# EAGLE design tqfp-sandwich-ui (EAGLE 9.6.2)
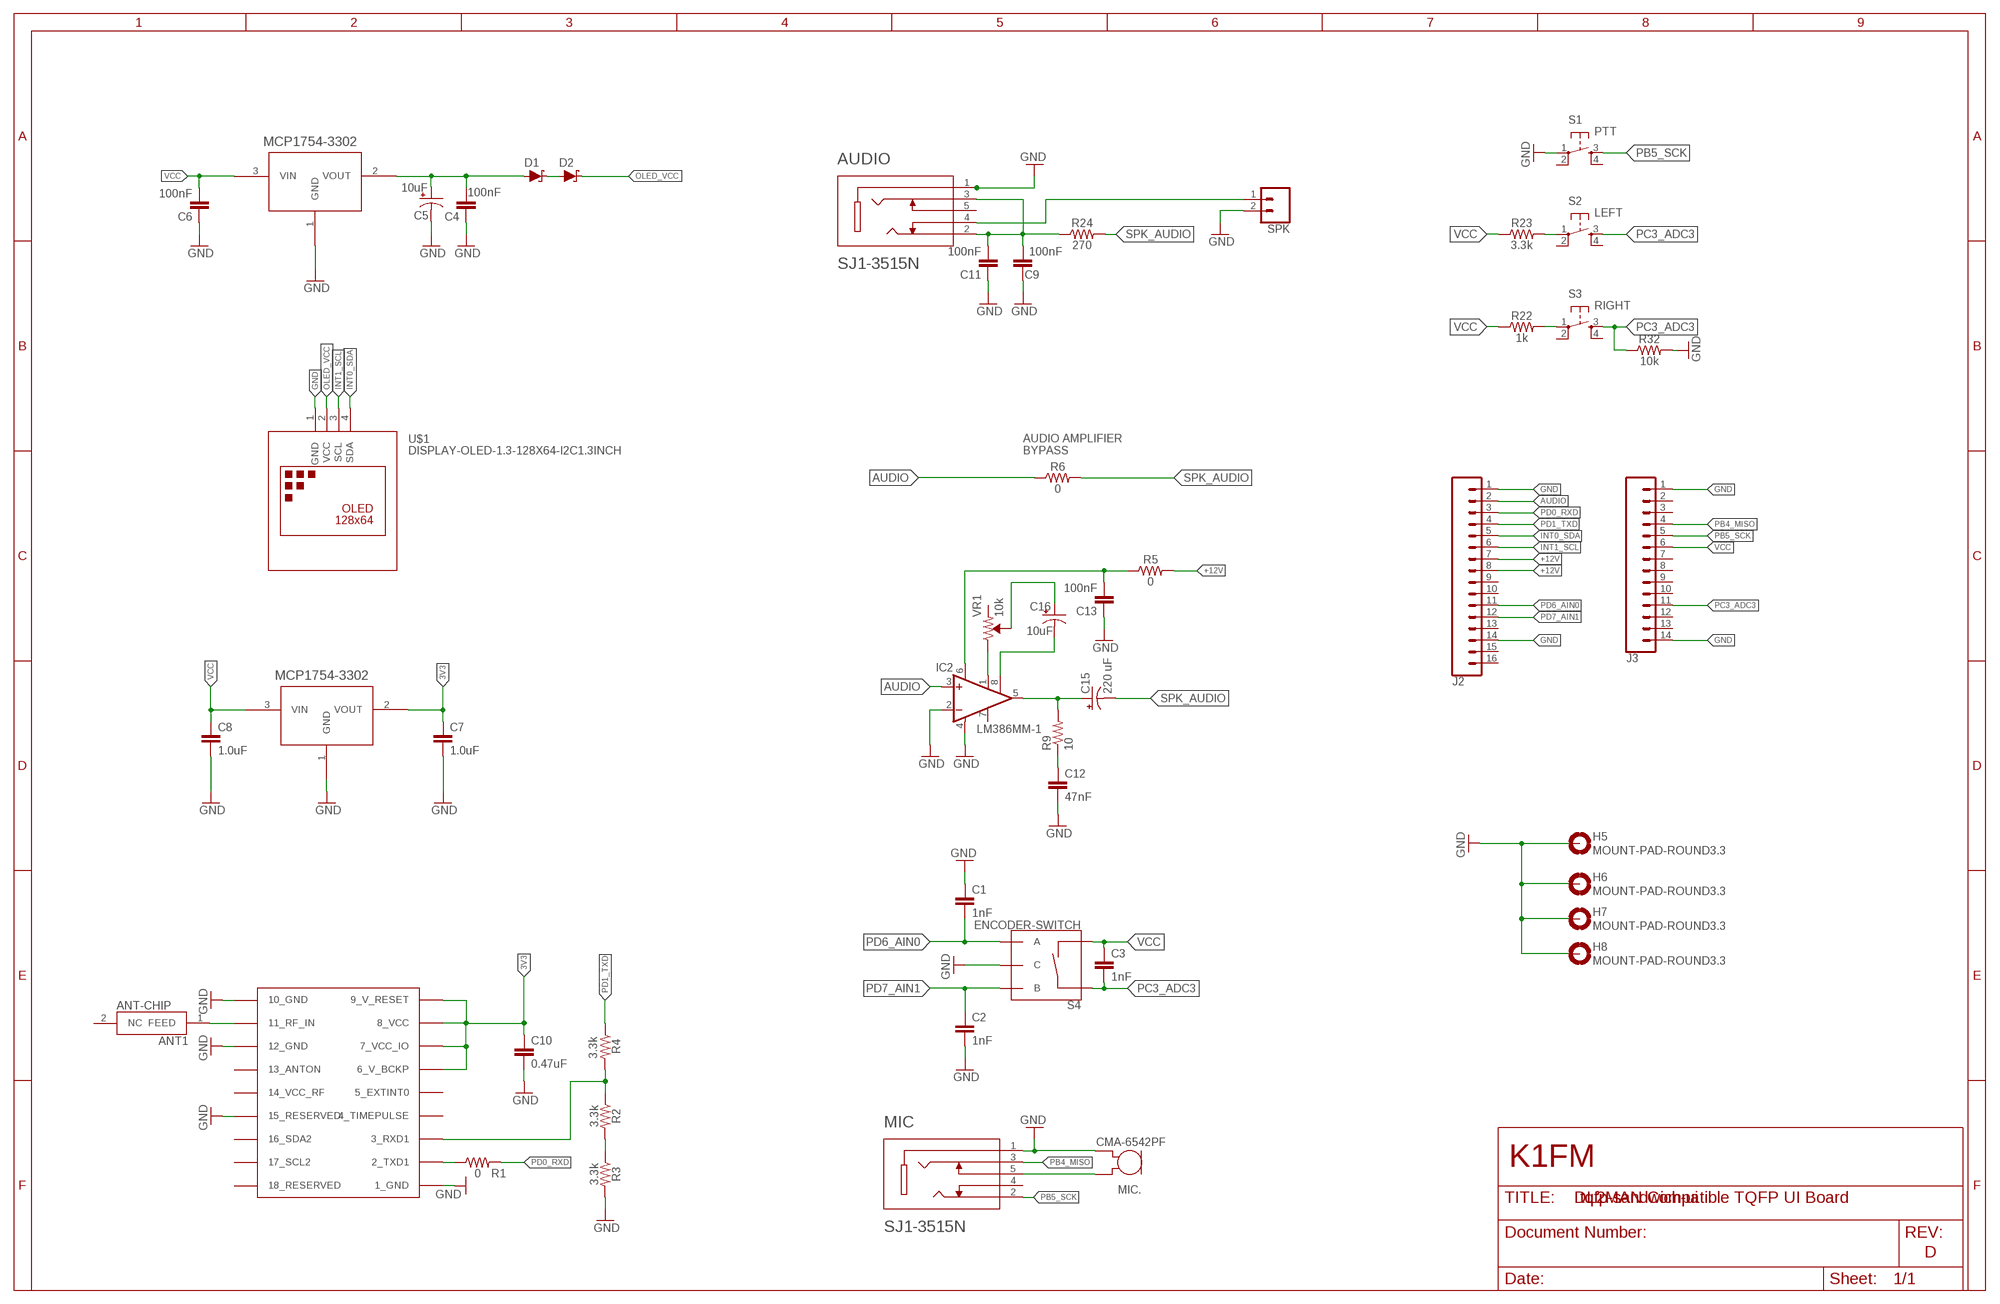
[diagram p0: schematic, sheet 1]

## Parts
ANT-CHIP  ANT1  1575AT43A0040E  [1575AT43A0040E]
AUDIO  SJ1-3515N  [CUI_SJ1-3515N]
C1  1nF  1.0NF/1000PF-0603-50V-10%  [0603]
C2  1nF  1.0NF/1000PF-0603-50V-10%  [0603]
C3  1nF  1.0NF/1000PF-0603-50V-10%  [0603]
C4  100nF  1.0NF/1000PF-0603-50V-10%  [0603]
C5  10uF  10UF-POLAR-EIA3216-16V-10%(TANT)  [EIA3216]
C6  100nF  1.0NF/1000PF-0603-50V-10%  [0603]
C7  1.0uF  1.0UF-0603-16V-10%  [0603]
C8  1.0uF  1.0UF-0603-16V-10%  [0603]
C9  100nF  1.0NF/1000PF-0603-50V-10%  [0603]
C10  0.47uF  0.1UF-0603-25V-5%  [0603]
C11  100nF  1.0NF/1000PF-0603-50V-10%  [0603]
C12  47nF  47NF-0603-25V-5%  [0603]
C13  100nF  1.0NF/1000PF-0603-50V-10%  [0603]
C15  220 uF  CPOL-USC  [PANASONIC_C]
C16  10uF  10UF-POLAR-EIA3216-16V-10%(TANT)  [EIA3216]
D1  1A/23V/620mV  DIODE-SCHOTTKY-BAT20J  [SOD-323]
D2  1A/23V/620mV  DIODE-SCHOTTKY-BAT20J  [SOD-323]
GPS1  UBLOX_MAX  [UBLOX_MAX]
H5  MOUNT-PAD-ROUND3.3  [3,3-PAD]
H6  MOUNT-PAD-ROUND3.3  [3,3-PAD]
H7  MOUNT-PAD-ROUND3.3  [3,3-PAD]
H8  MOUNT-PAD-ROUND3.3  [3,3-PAD]
IC2  LM386MM-1  [MMSOP08]
J2  CONN_16  [1X16]
J3  CONN_14  [1X14]
MIC  SJ1-3515N  [CUI_SJ1-3515N]
MIC.  CMA-6542PF  [CUI_CMA-6542PF]
R1  0  3.3KOHM-0603-1/10W-1%  [0603]
R2  3.3k  3.3KOHM-0603-1/10W-1%  [0603]
R3  3.3k  3.3KOHM-0603-1/10W-1%  [0603]
R4  3.3k  3.3KOHM-0603-1/10W-1%  [0603]
R5  0  0OHM-0603-1/10W-5%  [0603]
R6  0  0OHM-0603-1/10W-5%  [0603]
R9  10  10OHM-0603-1/10W-5%  [0603]
R22  1k  1KOHM-0603-1/10W-1%  [0603]
R23  3.3k  3.3KOHM-0603-1/10W-1%  [0603]
R24  270  287OHM-0603-1/10W-1%  [0603]
R32  10k  10KOHM-0603-1/10W-1%  [0603]
S1  PTT  DTSM-6  [DTSM-6]
S2  LEFT  DTSM-6  [DTSM-6]
S3  RIGHT  DTSM-6  [DTSM-6]
S4  ENCODER-SWITCH  [ROTARY_ENC_PLAIN]
SPK  CONN_02  [1X02]
U1  MCP1754X-XXXXX/C  [SOT-23A_MC]
U3  MCP1754X-XXXXX/C  [SOT-23A_MC]
U$1  DISPLAY-OLED-1.3-128X64-I2C1.3INCH  [DISPLAY-OLED-1.3-128X64-I2C]
VR1  10k  TRIMPOT-SMD-3MM-OPEN-1/10W-25%  [TRIMPOT-SMD-TC33X]

## Nets
3V3: C7.1 C10.1 GPS1.6_V_BCKP GPS1.7_VCC_IO GPS1.8_VCC GPS1.9_V_RESET U3.2(VOUT)
+12V: J2.7 J2.8 R5.2
AUDIO: IC2.3(+IN) J2.2 R6.1
GND: AUDIO.1 C1.1 C2.2 C4.1 C5.- C6.1 C7.2 C8.2 C9.1 C10.2 C11.1 C12.2 C13.1 GPS1.1_GND GPS1.10_GND GPS1.12_GND GPS1.15_RESERVED H5.B3,3(MOUNT) H6.B3,3(MOUNT) H7.B3,3(MOUNT) H8.B3,3(MOUNT) IC2.2(-IN) IC2.4(GND) J2.1 J2.14 J3.1 J3.14 MIC.1 MIC..GND R3.2 R32.2 S1.1 S4.C SPK.2 U1.1(GND) U3.1(GND) U$1.1(GND)
INT0_SDA: J2.5 U$1.4(SDA)
INT1_SCL: J2.6 U$1.3(SCL)
N$1: GPS1.2_TXD1 R1.1
N$2: MIC.5 MIC..OUT
N$3: GPS1.3_RXD1 R2.1 R4.2
N$4: R23.2 S2.1
N$5: R2.2 R3.1
N$6: ANT-CHIP.1(FEED) GPS1.11_RF_IN
N$7: D1.C D2.A
N$8: C4.2 C5.+ D1.A U1.2(VOUT)
N$9: C12.1 R9.1
N$10: AUDIO.4 SPK.1
N$11: C15.+ IC2.5(OUT) R9.2
N$21: IC2.1(GAIN) VR1.1(CW)
N$22: C16.+ VR1.2(WIPER)
N$23: C16.- IC2.8(GAIN)
N$24: C13.2 IC2.6(VS) R5.1
N$33: R22.2 S3.1
N$38: AUDIO.2 AUDIO.3 C9.2 C11.2 R24.1
OLED_VCC: D2.C U$1.2(VCC)
PB4_MISO: J3.4 MIC.3
PB5_SCK: J3.5 MIC.2 S1.3
PC3_ADC3: C3.2 J3.11 R32.1 S2.3 S3.3 S4.SW+
PD0_RXD: J2.3 R1.2
PD1_TXD: J2.4 R4.1
PD6_AIN0: C1.2 J2.11 S4.A
PD7_AIN1: C2.1 J2.12 S4.B
SPK_AUDIO: C15.- R6.2 R24.2
VCC: C3.1 C6.2 C8.1 J3.6 R22.1 R23.1 S4.SW- U1.3(VIN) U3.3(VIN)
Unconnected: ANT-CHIP.2(NC) AUDIO.5 GPS1.4_TIMEPULSE GPS1.5_EXTINT0 GPS1.13_ANTON GPS1.14_VCC_RF GPS1.16_SDA2 GPS1.17_SCL2 GPS1.18_RESERVED IC2.7(BYPASS) J2.9 J2.10 J2.13 J2.15 J2.16 J3.2 J3.3 J3.7 J3.8 J3.9 J3.10 J3.12 J3.13 MIC.4 S1.2 S1.4 S2.2 S2.4 S3.2 S3.4 VR1.3(CCW)

## Notes on the sheet
- AUDIO AMPLIFIER
  BYPASS
- K1FM
- DL2MAN Compatible TQFP UI Board
- D

## Library data of the parts
ANT-CHIP = samacsys_parts:1575AT43A0040E: Tri-Band GPS, BDS, and GLNSS, Low Cost, Linearly Polarized, Omnidirectional Chip Antenna Source: Datasheet <https://componentsearchengine.com/Datasheets/1/1575AT43A0040E.pdf>; DESCRIPTION: Tri-Band GPS, BDS, and GLNSS, Low Cost, Linearly Polarized, Omnidirectional Chip Antenna; HEIGHT: mm; MANUFACTURER_NAME: JOHANSON TECHNOLOGY; MANUFACTURER_PART_NUMBER: 1575AT43A0040E; MOUSER_PART_NUMBER: 609-1575AT43A0040E; MOUSER_PRICE-STOCK: https://www.mouser.com/Search/Refine.aspx?Keyword=609-1575AT43A0040E
AUDIO MIC = SJ1-3515N:SJ1-3515N: 3.5 mm Right-Angle Stereo Jack, 5 Pin PCB Mount, Non-Threaded; MANUFACTURER: CUI; PARTREV: 1.03; STANDARD: Manufacturer recommendation
C1-C3 = SparkFun-Capacitors:1.0NF/1000PF: 1nF/1,000pF ceramic capacitors A capacitor is a passive two-terminal electrical component used to store electrical energy temporarily in an electric field.; PROD_ID: CAP-07886
C4 C6 C9 C11 C13 = SparkFun-Capacitors:1.0NF/1000PF: 1nF/1,000pF ceramic capacitors A capacitor is a passive two-terminal electrical component used to store electrical energy temporarily in an electric field.; PROD_ID: CAP-07886; VALUE: 1nF
C5 C16 = SparkFun-Capacitors:10UF-POLAR: 10.0µF polarized capacitors A capacitor is a passive two-terminal electrical component used to store electrical energy temporarily in an electric field.; PROD_ID: CAP-00811
C7 C8 = SparkFun-Capacitors:1.0UF: 1µF ceramic capacitors A capacitor is a passive two-terminal electrical component used to store electrical energy temporarily in an electric field.; PROD_ID: CAP-00868
C10 = SparkFun-Capacitors:0.1UF: 0.1µF ceramic capacitors A capacitor is a passive two-terminal electrical component used to store electrical energy temporarily in an electric field.; PROD_ID: CAP-08604; VALUE: 0.1uF
C12 = SparkFun-Capacitors:47NF: 47nF ceramic capacitors A capacitor is a passive two-terminal electrical component used to store electrical energy temporarily in an electric field.; PROD_ID: CAP-08605
C15 = rcl:CPOL-US: POLARIZED CAPACITOR, American symbol; SPICEPREFIX: C
D1 D2 = SparkFun-DiscreteSemi:DIODE-SCHOTTKY: Schottky diode A Schottky diode is a semiconductor diode which has a low forward voltage drop and a very fast switching action.; PROD_ID: DIO-11623
GPS1 = Ava:UBLOX_MAX: UBLOX MAX
H5-H8 = holes:MOUNT-PAD-ROUND: MOUNTING PAD, round
IC2 = linear:LM386?-*: Low Voltage Audio Power Amplifier Source: http://cache.national.com/ds/LM/LM386.pdf
J2 = SparkFun-Connectors:CONN_16: Multi connection point. Often used as Generic Header-pin footprint for 0.1 inch spaced/style header connections On any of the 0.1 inch spaced packages, you can populate with these: Break Away Headers - Straight <https://www.sparkfun.com/products/116> (PRT-00116) Break Away Male Headers - Right Angle <https://www.sparkfun.com/products/553> (PRT-00553) Female Headers <https://www.sparkfun.com/products/115> (PRT-00115) Break Away Headers - Machine Pin <https://www.sparkfun.com/products/117> (PRT-00117) Break Away Female Headers - Swiss Machine Pin <https://www.sparkfun.com/products/743> (PRT-00743) For SCREWTERMINALS and SPRING TERMINALS visit here: Screw Terimnals on SparkFun.com <https://www.sparkfun.com/search/results?term=Screw+Terminals> (5mm/3.5mm/2.54mm spacing) This device is also useful as a general connection point to wire up your design to another part of your project. Our various solder wires solder well into these plated through hole pads. Hook-Up Wire - Assortment (Stranded, 22 AWG) <https://www.sparkfun.com/products/11375> (PRT-11375) Hook-Up Wire - Assortment (Solid Core, 22 AWG) <https://www.sparkfun.com/products/11367> (PRT-11367) View the entire wire category on our website here <https://www.sparkfun.com/categories/141> Special notes: Molex polarized connector foot print use with SKU : PRT-08231 with associated crimp pins and housings. 1MM SMD Version SKU: PRT-10208 NOTES ON THE VARIANTS LOCK and LOCK_LONGPADS... This footprint was designed to help hold the alignment of a through-hole component (i.e. 6-pin header) while soldering it into place. You may notice that each hole has been shifted either up or down by 0.005 of an inch from it's more standard position (which is a perfectly straight line). This slight alteration caused the pins (the squares in the middle) to touch the edges of the holes. Because they are alternating, it causes a "brace" to hold the component in place. 0.005 has proven to be the perfect amount of "off-center" position when using our standard breakaway headers. Although looks a little odd when you look at the bare footprint, once you have a header in there, the alteration is very hard to notice. Also,if you push a header all the way into place, it is covered up entirely on the bottom side.
J3 = SparkFun-Connectors:CONN_14: Multi connection point. Often used as Generic Header-pin footprint for 0.1 inch spaced/style header connections On any of the 0.1 inch spaced packages, you can populate with these: Break Away Headers - Straight <https://www.sparkfun.com/products/116> (PRT-00116) Break Away Male Headers - Right Angle <https://www.sparkfun.com/products/553> (PRT-00553) Female Headers <https://www.sparkfun.com/products/115> (PRT-00115) Break Away Headers - Machine Pin <https://www.sparkfun.com/products/117> (PRT-00117) Break Away Female Headers - Swiss Machine Pin <https://www.sparkfun.com/products/743> (PRT-00743) For SCREWTERMINALS and SPRING TERMINALS visit here: Screw Terimnals on SparkFun.com <https://www.sparkfun.com/search/results?term=Screw+Terminals> (5mm/3.5mm/2.54mm spacing) This device is also useful as a general connection point to wire up your design to another part of your project. Our various solder wires solder well into these plated through hole pads. Hook-Up Wire - Assortment (Stranded, 22 AWG) <https://www.sparkfun.com/products/11375> (PRT-11375) Hook-Up Wire - Assortment (Solid Core, 22 AWG) <https://www.sparkfun.com/products/11367> (PRT-11367) View the entire wire category on our website here <https://www.sparkfun.com/categories/141> Special notes: Molex polarized connector foot print use with SKU : PRT-08231 with associated crimp pins and housings. 1MM SMD Version SKU: PRT-10208 NOTES ON THE VARIANTS LOCK and LOCK_LONGPADS... This footprint was designed to help hold the alignment of a through-hole component (i.e. 6-pin header) while soldering it into place. You may notice that each hole has been shifted either up or down by 0.005 of an inch from it's more standard position (which is a perfectly straight line). This slight alteration caused the pins (the squares in the middle) to touch the edges of the holes. Because they are alternating, it causes a "brace" to hold the component in place. 0.005 has proven to be the perfect amount of "off-center" position when using our standard breakaway headers. Although looks a little odd when you look at the bare footprint, once you have a header in there, the alteration is very hard to notice. Also,if you push a header all the way into place, it is covered up entirely on the bottom side.
MIC. = CMA-6542PF:CMA-6542PF: 9.7 mm, Omnidirectional, PCB Mount, 4.5 Vdc, Electret Condenser Microphone; MANUFACTURER: CUI INC; PARTREV: 1.02; STANDARD: Manufacturer recommendations
R1 = SparkFun-Resistors:3.3KOHM: 3.3kΩ resistor A resistor is a passive two-terminal electrical component that implements electrical resistance as a circuit element. Resistors act to reduce current flow, and, at the same time, act to lower voltage levels within circuits. - Wikipedia; PROD_ID: RES-07851; VALUE: 3.3k
R2-R4 R23 = SparkFun-Resistors:3.3KOHM: 3.3kΩ resistor A resistor is a passive two-terminal electrical component that implements electrical resistance as a circuit element. Resistors act to reduce current flow, and, at the same time, act to lower voltage levels within circuits. - Wikipedia; PROD_ID: RES-07851
R5 R6 = SparkFun-Resistors:0OHM: 0Ω resistor A resistor is a passive two-terminal electrical component that implements electrical resistance as a circuit element. Resistors act to reduce current flow, and, at the same time, act to lower voltage levels within circuits. - Wikipedia; PROD_ID: RES-08609
R9 = SparkFun-Resistors:10OHM: 10Ω resistor A resistor is a passive two-terminal electrical component that implements electrical resistance as a circuit element. Resistors act to reduce current flow, and, at the same time, act to lower voltage levels within circuits. - Wikipedia; PROD_ID: RES-09834
R22 = SparkFun-Resistors:1KOHM: 1kΩ resistor A resistor is a passive two-terminal electrical component that implements electrical resistance as a circuit element. Resistors act to reduce current flow, and, at the same time, act to lower voltage levels within circuits. - Wikipedia; PROD_ID: RES-07856
R24 = SparkFun-Resistors:287OHM: 287Ω resistor A resistor is a passive two-terminal electrical component that implements electrical resistance as a circuit element. Resistors act to reduce current flow, and, at the same time, act to lower voltage levels within circuits. - Wikipedia; PROD_ID: RES-10752; VALUE: 287
R32 = SparkFun-Resistors:10KOHM: 10kΩ resistor A resistor is a passive two-terminal electrical component that implements electrical resistance as a circuit element. Resistors act to reduce current flow, and, at the same time, act to lower voltage levels within circuits. - Wikipedia; PROD_ID: RES-00824
S1-S3 = switch-tact:DTSM-6
S4 = SparkFun-Switches:ENCODER-SWITCH: Rotary Encoder w/ Select Switch Encoders rotate similarly to potentiometers, but they’re different from potentiometers in that an encoder has full rotation without limits. They output gray code so that you can tell how much and in which direction the encoder has been turned. This encoder includes a push-down select switch built into the shaft. SparkFun Products Rotary Encoder <https://www.sparkfun.com/products/9117> (COM-09117); SF_SKU: COM-09117
SPK = SparkFun-Connectors:CONN_02: Multi connection point. Often used as Generic Header-pin footprint for 0.1 inch spaced/style header connections On any of the 0.1 inch spaced packages, you can populate with these: Break Away Headers - Straight <https://www.sparkfun.com/products/116> (PRT-00116) Break Away Male Headers - Right Angle <https://www.sparkfun.com/products/553> (PRT-00553) Female Headers <https://www.sparkfun.com/products/115> (PRT-00115) Break Away Headers - Machine Pin <https://www.sparkfun.com/products/117> (PRT-00117) Break Away Female Headers - Swiss Machine Pin <https://www.sparkfun.com/products/743> (PRT-00743) For SCREWTERMINALS and SPRING TERMINALS visit here: Screw Terimnals on SparkFun.com <https://www.sparkfun.com/search/results?term=Screw+Terminals> (5mm/3.5mm/2.54mm spacing) This device is also useful as a general connection point to wire up your design to another part of your project. Our various solder wires solder well into these plated through hole pads. Hook-Up Wire - Assortment (Stranded, 22 AWG) <https://www.sparkfun.com/products/11375> (PRT-11375) Hook-Up Wire - Assortment (Solid Core, 22 AWG) <https://www.sparkfun.com/products/11367> (PRT-11367) View the entire wire category on our website here <https://www.sparkfun.com/categories/141> Special notes: Molex polarized connector foot print use with: PRT-08233 with associated crimp pins and housings. 2.54_SCREWTERM for use with PRT-10571. 3.5mm Screw Terminal footprints for PRT-08084 5mm Screw Terminal footprints for use with PRT-08432
U1 U3 = MCP1754:MCP1754X-XXXXX/C
U$1 = diy-modules:DISPLAY-OLED-1.3-128X64-I2C: 128x64 Dot Matrix OLED Module based on SSD1306 chip Variant with I2C interface More details available here: http://www.instructables.com/id/Monochrome-096-i2c-OLED-display-with-arduino-SSD13/ SSD1306 datasheet: https://cdn-shop.adafruit.com/datasheets/SSD1306.pdf Click here to find device on ebay.com <http://www.ebay.com/sch/oled+display+128x64+iic> Note: There are two variants: I2C and SPI. Search for the proper version.
VR1 = SparkFun-Resistors:TRIMPOT: Trimming Potentiometer (Trimpot) Three-terminal potentiometers, with an adjustable wiper and two adjustable resistors. A pot can be used to create a configurable voltage divider, or as a variable resistor. "Trimpots" are a subset of potentiometers, usually intended for "set-and-forget" applications. They're often more delicate than standard potentiometers - rated for fewer turns. Variants PTH-KNOB - PTH Trimpot w/ finger-adjustable knob Trimpot 10K with Knob <https://www.sparkfun.com/products/9806> (COM-09806) Datasheet <http://www.sparkfun.com/datasheets/Components/General/TSR-3386.pdf> SMD-3MM-CLOSED-FRAME - SMD 3mm Square Closed-Frame Trimpot Used on e.g. EasyDriver - Stepper Motor Driver <https://www.sparkfun.com/products/12779> Datasheet <http://www.bitechnologies.com/pdfs/22.pdf> (22AR10KTR) SMD-5MM - SMD 5mm Square Closed-Frame Trimpot Used on e.g. IOIO-OTG - V2.2 <https://www.sparkfun.com/products/13613> Datasheet <http://www.vishay.com/docs/51008/ts53.pdf> (TS53YL502MR10) SMD-3MM-1/10W-25% - 3mm Square Open-Frame Trimpot Used on e.g. SparkFun Shapeoko <https://www.sparkfun.com/products/13899> Datasheet <http://www.bourns.com/docs/Product-Datasheets/TC33.pdf> (TC33X-2-103E); PROD_ID: RES-12428

## Board
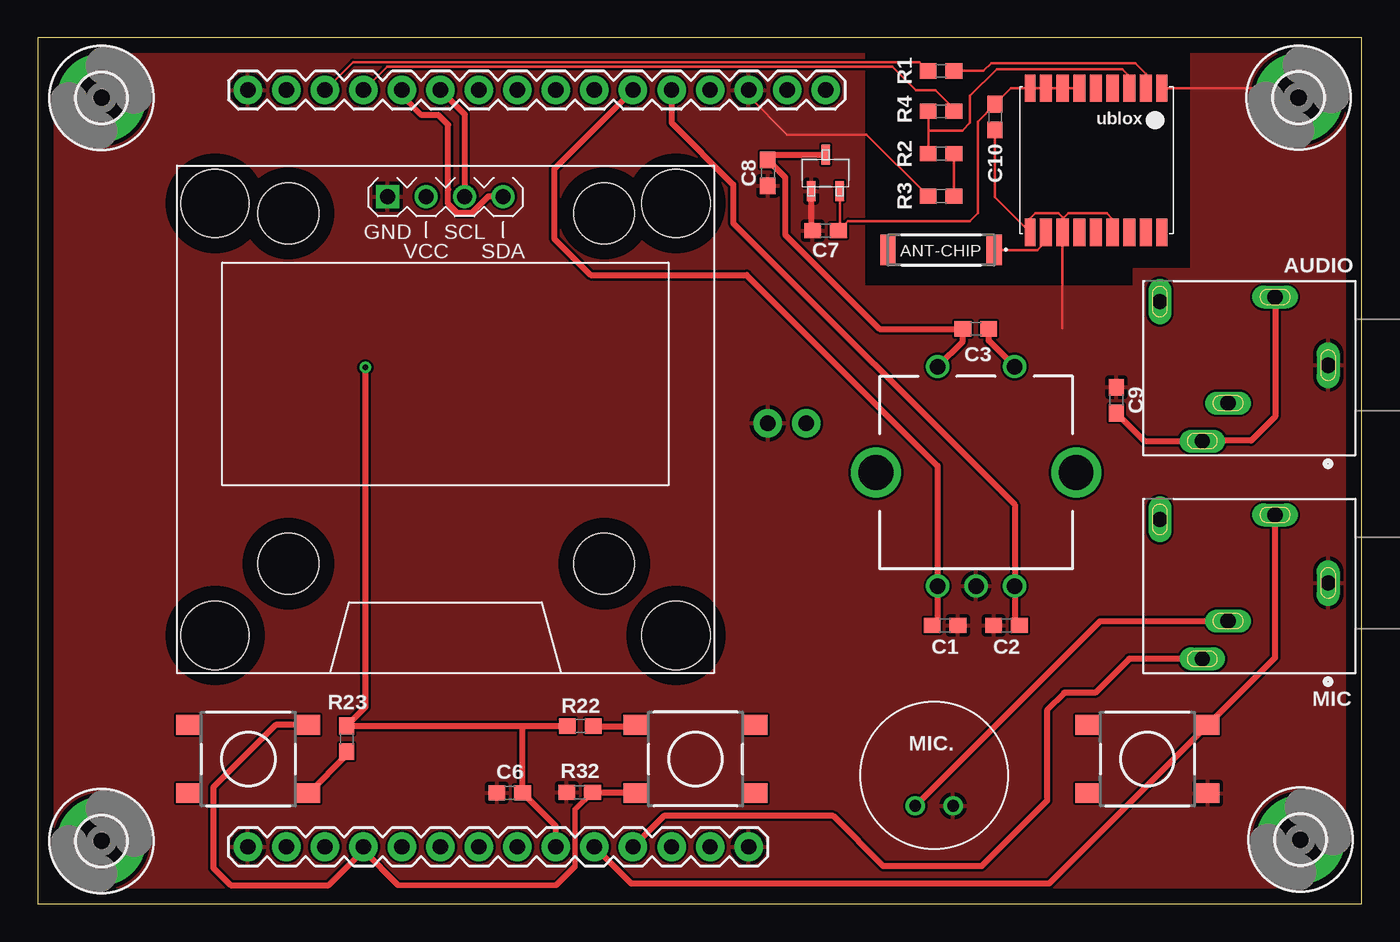
[diagram p1: board, top side]
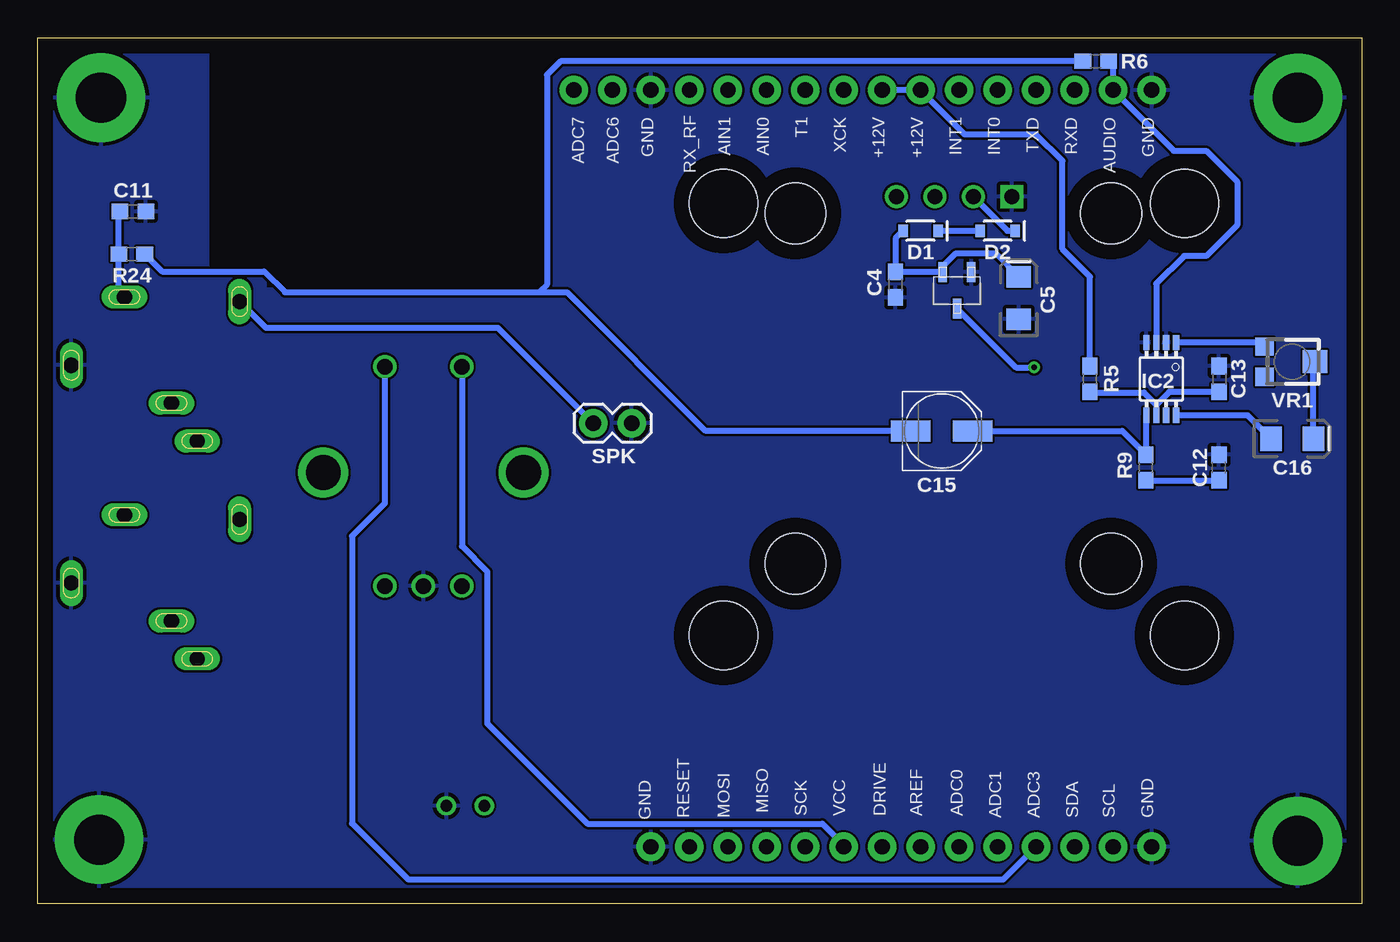
[diagram p2: board, bottom side, seen from below]

Size 87.3 x 57.11 mm. Coordinates in mm from the lower left corner, seen from the top.
Outline: 87.3,57.11 0,57.11 0,0 87.3,0 87.3,57.11
Copper layers (1*16): Top 0.035mm / dielectric 1.5mm / Bottom 0.035mm
Design rules "default": minimum track width 6mil, minimum drill 0.35mm, track to track 6mil, track to pad 6mil, pad to pad 6mil, via to via 6mil, smd to smd 6mil, copper to edge 40mil, drill to drill 6mil, minimum pad ring 10mil, minimum via ring 8mil, stop-mask expansion 4mil, vias tented up to drill 0mil, thermal gap 10mil
Holes 4 mm at 16.52,45.54 37.34,45.54 37.34,22.42 16.52,22.42

### Footprints (pad centres in the part's own frame; a part is rotated, then mirrored left to right if it is on the bottom)
1575AT43A0040E = smd 1 x 2: 1 3.5,0; 2 -3.5,0
CUI_SJ1-3515N = drill 1 long: 1 0,0; 2 3.5,-4.5; 3 8.3,5; 4 11.1,-4.2; 5 6.6,2.5
0603 = smd 1.1 x 1: 1 -0.85,0; 2 0.85,0
EIA3216 = smd 1.4 x 1.6: + 1.4,0; - -1.4,0
PANASONIC_C = smd 2.6 x 1.4: + 2.05,0; - -2.05,0
SOD-323 = smd 0.63 x 0.83: A 1.15,0; C -1.15,0
UBLOX_MAX = smd 1.8 x 0.7: 1_GND 4.95,-4.4; 9_V_RESET 4.95,4.3; 10_GND -4.55,4.3; 18_RESERVED -4.55,-4.4 | smd 1.8 x 0.8: 2_TXD1 4.95,-3.35; 3_RXD1 4.95,-2.25; 4_TIMEPULSE 4.95,-1.15; 5_EXTINT0 4.95,-0.05; 6_V_BCKP 4.95,1.05; 7_VCC_IO 4.95,2.15; 8_VCC 4.95,3.25; 11_RF_IN -4.55,3.25; 12_GND -4.55,2.15; 13_ANTON -4.55,1.05; 14_VCC_RF -4.55,-0.05; 15_RESERVED -4.55,-1.15; 16_SDA2 -4.55,-2.25; 17_SCL2 -4.55,-3.35
3,3-PAD = drill 3.3 pad 5.842: B3,3 0,0
MMSOP08 = smd 0.41 x 1.02: 1 -0.975,-2.4; 2 -0.325,-2.4; 3 0.325,-2.4; 4 0.975,-2.4; 5 0.975,2.4; 6 0.325,2.4; 7 -0.325,2.4; 8 -0.975,2.4
1X16 = drill 1.016 pad 1.88: 1 0,0; 2 2.54,0; 3 5.08,0; 4 7.62,0; 5 10.16,0; 6 12.7,0; 7 15.24,0; 8 17.78,0; 9 20.32,0; 10 22.86,0; 11 25.4,0; 12 27.94,0; 13 30.48,0; 14 33.02,0; 15 35.56,0; 16 38.1,0
1X14 = drill 1.016 pad 1.88: 1 0,0; 2 2.54,0; 3 5.08,0; 4 7.62,0; 5 10.16,0; 6 12.7,0; 7 15.24,0; 8 17.78,0; 9 20.32,0; 10 22.86,0; 11 25.4,0; 12 27.94,0; 13 30.48,0; 14 33.02,0
CUI_CMA-6542PF = drill 0.77: GND -2,-1.25; OUT -2,1.25
DTSM-6 = smd 1.55 x 1.3: 1 -3.975,2.25; 2 3.975,2.25; 3 -3.975,-2.25; 4 3.975,-2.25
ROTARY_ENC_PLAIN = drill 1.016: A 7.493,-2.54; B 7.493,2.54; C 7.493,0; SW+ -6.985,2.54; SW- -6.985,-2.54 | drill 2.286: P$3 0,6.604; P$4 0,-6.604
1X02 = drill 1.016 pad 1.88: 1 0,0; 2 2.54,0
SOT-23A_MC = smd 0.559 x 1.321: 1 -0.94,-1.194; 2 0.94,-1.194; 3 0,1.194
DISPLAY-OLED-1.3-128X64-I2C = drill 1 square: 1 -3.81,14.7 | drill 1: 2 -1.27,14.7; 3 1.27,14.7; 4 3.81,14.7 | hole 4.5: -15.2,14.25; 15.2,14.25; 15.2,-14.25; -15.2,-14.25
TRIMPOT-SMD-TC33X = smd 1.2 x 1.2: 1 -1,-1.825; 3 1,-1.825 | smd 1.5 x 1.6: 2 0,1.5

### Placement (x,y rotation side)
ANT-CHIP  59.57,43.12 0 top
AUDIO  85.09,35.52 180 top
C1  59.82,18.36 180 top
C2  63.89,18.36 180 top
C3  61.85,37.91 0 top
C4  30.74,40.84 90 bottom
C5  22.61,39.95 90 bottom
C6  31.12,7.31 0 top
C7  51.95,44.39 180 top
C8  48.14,48.2 270 top
C9  71.12,33.22 270 top
C10  63.12,51.88 270 top
C11  81.03,45.66 180 bottom
C12  9.4,28.77 90 bottom
C13  9.4,34.61 270 bottom
C15  27.69,31.18 0 bottom
C16  4.58,30.68 0 bottom
D1  29.09,44.39 180 bottom
D2  24.01,44.39 180 bottom
GPS1  69.73,48.84 90 top
H5  83.27,4.23 180 top
H6  4.2,4.13 180 top
H7  83.14,53.17 180 top
H8  4.2,53.16 180 top
IC2  13.21,34.61 180 bottom
J2  13.85,53.66 0 top
J3  46.87,3.75 180 top
MIC  85.09,21.15 180 top
MIC.  59.11,8.45 90 top
R1  59.57,54.93 180 top
R2  59.57,49.47 0 top
R3  59.57,46.68 180 top
R4  59.57,52.27 180 top
R5  17.91,34.61 90 bottom
R6  17.53,55.57 180 bottom
R9  14.23,28.77 90 bottom
R22  35.77,11.71 0 top
R23  20.37,10.88 270 top
R24  81.11,42.85 0 bottom
R32  35.73,7.36 180 top
S1  73.18,9.54 180 top
S2  13.88,9.54 180 top
S3  43.38,9.54 0 top
S4  61.88,28.44 270 top
SPK  50.68,31.69 0 bottom
U1  26.68,40.45 180 bottom
U3  51.95,48.2 0 top
U$1  26.88,31.94 0 top
VR1  4.58,35.76 270 bottom

### Tracks (layer width: path | path; a pad name or v marks a point on that pad's centre or on a via)
3V3
  Top 0.152: GPS1.6_V_BCKP GPS1.7_VCC_IO GPS1.8_VCC GPS1.9_V_RESET 64.18,53.79 C10.1 61.98,51.59 61.98,45.54 61.47,45.03 53.43,45.03 C7.1 52.89,44.48 U3.2
+12V
  Bottom 0.406: J2.8 J2.7 26.17,50.74 21.47,50.74 19.73,49.01 19.73,43.19 17.91,41.36 R5.2
AUDIO
  Bottom 0.406: IC2.3 13.54,40.89 11.71,42.72 10.24,42.72 8.21,44.76 8.21,47.63 10.24,49.66 12.39,49.66 J2.2 16.39,55.27 R6.1
GND
  Top 0.152: GPS1.15_RESERVED 70.88,45.15 70.49,45.54 67.95,45.54 67.58,45.16 GPS1.12_GND | C10.2 63.12,46.59 GPS1.10_GND 65.43,45.17 65.79,45.54 67.31,45.54 67.58,45.27 GPS1.12_GND | GPS1.12_GND 67.58,37.98 | GPS1.1_GND 82.52,53.79 H7.B3,3 | R3.2 54.65,50.74 49.41,50.74 46.87,53.28 J2.14
  Top 0.406: C7.2 51.01,44.48 U3.1
  pour Top: -0.12,57.09 54.49,57.09 54.49,40.71 72.27,40.71 72.27,41.85 76.08,41.85 76.08,57.09 87.51,57.09 87.51,-0.06 -0.12,-0.06
  pour Bottom: -0.12,57.09 54.49,57.09 54.49,40.58 72.27,40.58 72.27,41.85 76.08,41.85 76.08,57.09 87.51,57.09 87.51,-0.06 -0.12,-0.06
INT0_SDA
  Top 0.381: U$1.4 29.7,46.64 28.6,45.55 27.69,45.55 27.05,46.19 27.05,47.1 27.06,47.1 27.06,51.38 26.42,52.01 25.28,52.01 24.01,53.28 J2.5
INT1_SCL
  Top 0.381: J2.6 28.15,52.06 U$1.3
N$1
  Top 0.152: R1.1 62.36,54.93 62.88,55.45 72.38,55.45 73.08,54.76 GPS1.2_TXD1
N$2
  Top 0.406: MIC..OUT 70.06,18.65 MIC.5
N$3
  Top 0.152: R4.2 58.72,51 | 58.72,51 R2.1 | GPS1.3_RXD1 71.98,54.59 71.51,55.06 63.25,55.06 61.47,53.28 61.47,51.5 60.97,51 58.72,51
N$4
  Top 0.406: S2.1 20.37,9.81 R23.2
N$5
  Top 0.152: R2.2 R3.1
N$6
  Top 0.152: ANT-CHIP.1 65.92,43.12 66.48,43.68 GPS1.11_RF_IN
N$7
  Bottom 0.406: D1.C D2.A
N$8
  Bottom 0.406: 22.4,41.56 C5.+ 24.13,42.87 26.8,42.87 27.61,42.05 27.61,41.69 | 30.61,41.69 C4.2 | 27.61,41.69 U1.2 | C4.2 27.61,41.69 | D1.A 30.74,43.89 C4.2
N$9
  Bottom 0.406: R9.1 C12.1
N$10
  Bottom 0.406: SPK.1 56.98,37.99 72.27,37.99 AUDIO.4
N$11
  Bottom 0.406: IC2.5 14.19,29.66 R9.2 15.79,31.18 C15.+
N$21
  Bottom 0.406: VR1.1 6.66,37.01 IC2.1
N$22
  Bottom 0.406: C16.+ 3.18,35.66 VR1.2
N$23
  Bottom 0.406: C16.- 7.51,32.21 IC2.8
N$24
  Bottom 0.406: R5.1 17.87,33.72 14.36,33.72 13.54,32.91 | 13.54,32.91 IC2.6 | C13.2 12.68,33.76 13.54,32.91
N$33
  Top 0.152: 39.32,11.71 S3.1
  Top 0.406: R22.2 39.32,11.71
N$38
  Top 0.406: C9.2 72.97,30.52 AUDIO.3 76.83,30.55 80.02,30.55 81.59,32.13 AUDIO.2
  Bottom 0.406: AUDIO.2 81.96,40.38 R24.1 81.96,45.58 C11.2
OLED_VCC
  Bottom 0.406: U$1.2 23.37,44.39 D2.C
PB4_MISO
  Top 0.406: MIC.3 71.97,16.15 69.73,13.91 67.7,13.91 66.55,12.77 66.55,6.8 62.23,2.48 55.76,2.48 52.46,5.78 41.28,5.78 J3.4
PB5_SCK
  Top 0.152: S1.3 77.42,12.06
  Top 0.406: J3.5 39.12,1.34 66.7,1.34 77.42,12.06 | S1.3 81.59,16.23 MIC.2
PC3_ADC3
  Top 0.152: R32.1 36.71,7.36 | S2.3 17.14,12.09 | 38.7,7.36 38.77,7.29 39.25,7.29 S3.3
  Top 0.356: R32.1 35.44,6.21 35.44,2.48 34.17,1.21 23.76,1.21 21.47,3.51
  Top 0.406: R32.1 39.18,7.36 39.25,7.29 | S2.3 15.67,11.79 11.56,7.69 11.56,2.36 12.71,1.22 19.18,1.22 21.47,3.51 J3.11 | S4.SW+ 62.7,37.14 C3.2
  Bottom 0.406: J3.11 23.63,1.59 62.87,1.59 66.58,5.3 66.58,24.25 64.42,26.41 S4.SW+
PD0_RXD
  Top 0.152: J2.3 20.78,55.52 58.13,55.52 R1.2
PD1_TXD
  Top 0.152: J2.4 23.02,55.21 56.37,55.21 57.92,53.66 59.19,53.66 60.42,52.43 R4.1
PD6_AIN0
  Top 0.152: 59.08,18.46 C1.2
  Top 0.406: J2.11 34.04,48.46 34.04,43.88 36.45,41.47 46.74,41.47 59.34,28.87 S4.A 59.34,18.72 59.08,18.46
PD7_AIN1
  Top 0.152: S4.B 64.43,20.93
  Top 0.406: J2.12 41.79,51.5 45.85,47.44 45.85,44.9 64.43,26.32 64.43,20.93 | S4.B 64.42,18.68 C2.1
SPK_AUDIO
  Bottom 0.406: 54.23,40.33 53.73,40.84 53.73,54.68 52.84,55.57 R6.2 | 54.23,40.33 71,40.33 72.38,41.71 79.12,41.71 R24.2 | 54.23,40.33 52.4,40.33 43.26,31.18 C15.-
VCC  (via drill 0.35)
  Top 0.406: 32.01,11.73 R23.1 21.59,12.95 v21.59,35.38 | 32.01,11.73 34.91,11.73 R22.1 | 32.01,11.73 31.97,11.69 C6.2 34.17,5.11 J3.6 | S4.SW- 61,37.09 C3.1 55.5,37.91 49.28,44.14 49.28,47.91 C8.1 48.48,49.4 U3.3
  Bottom 0.406: J3.6 34.17,3.88 35.56,5.28 51.06,5.28 57.66,11.88 57.66,21.91 59.34,23.59 S4.SW- | U1.3 22.79,35.38 v21.59,35.38

### Text on the board
bNames: GND | AUDIO | RXD | TXD | INT0 | INT1 | +12V | +12V | XCK | T1 | AIN0 | AIN1 | RX_RF | GND | ADC6 | ADC7 | GND | SCL | SDA | ADC3 | ADC1 | ADC0 | AREF | DRIVE | VCC | SCK | MISO | MOSI | RESET | GND
tValues: GPS | OPTIONAL | K1FM | OLED - GPS / DL2MAN UI Compatible / Rev. D
bValues: DO NOT INSTALL -> | TO BYPASS / INSTALL R6 | AUDIO / AMPLIFIER